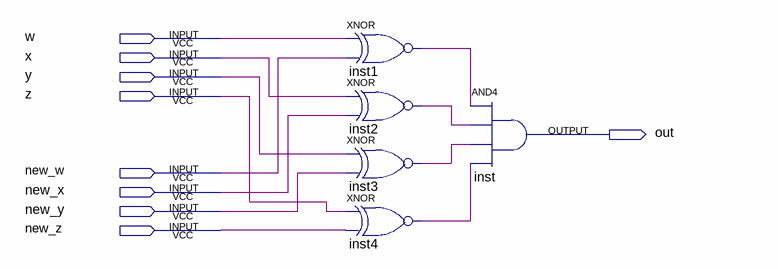
[diagram p0: schematic sheet]
// Quartus schematic compare_1_2.bdf as structural Verilog: 5 symbols, 9 pins
module compare_1_2 (
  input  w,
  input  x,
  input  y,
  input  z,
  input  new_w,
  input  new_x,
  input  new_y,
  input  new_z,
  output out
);

  wire inst1_out, inst2_out, inst3_out, inst4_out;

  xnor inst1 (inst1_out, w, new_w);
  xnor inst2 (inst2_out, x, new_x);
  xnor inst3 (inst3_out, y, new_y);
  xnor inst4 (inst4_out, z, new_z);
  and inst (out, inst1_out, inst2_out, inst3_out, inst4_out);
endmodule
